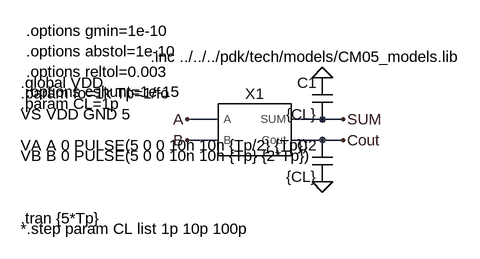
[diagram p0: schematic HA_sim.asc]
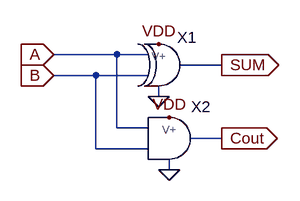
[diagram p1: sub-circuit ha.asc]
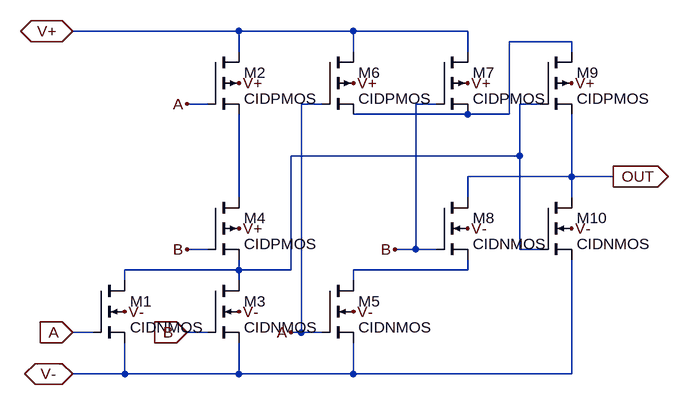
[diagram p2: sub-circuit xor2x1.asc]
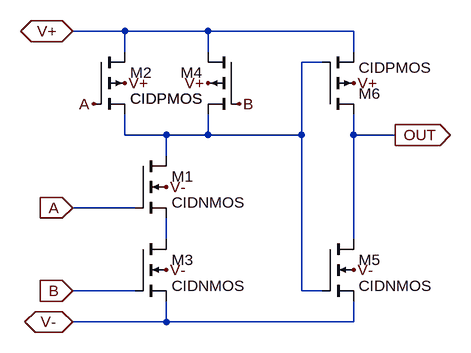
[diagram p3: sub-circuit and2x1.asc]
HA_sim.asc, the LTspice schematic file:
Version 4.1
SHEET 1 880 680
WIRE 48 112 0 112
WIRE 208 112 160 112
WIRE 240 112 208 112
WIRE 48 144 0 144
WIRE 208 144 160 144
WIRE 240 144 208 144
FLAG 0 112 A
FLAG 0 144 B
FLAG 240 112 SUM
FLAG 240 144 Cout
FLAG 208 208 0
FLAG 208 48 0
SYMBOL cap 224 48 M0
SYMATTR InstName C1
SYMATTR Value {CL}
SYMBOL cap 224 144 M0
SYMATTR InstName C2
SYMATTR Value {CL}
SYMBOL HA 96 128 R0
SYMATTR InstName X1
TEXT -56 16 Left 2 !.inc ../../../pdk/tech/models/CM05_models.lib
TEXT -256 152 Left 2 !VA A 0 PULSE(5 0 0 10n 10n {Tp/2} {Tp})
TEXT -256 168 Left 2 !VB B 0 PULSE(5 0 0 10n 10n {Tp} {2*Tp})
TEXT -256 264 Left 2 !.tran {5*Tp}
TEXT -256 56 Left 2 !.global VDD
TEXT -256 88 Left 2 !.param CL=1p
TEXT -256 280 Left 2 !*.step param CL list 1p 10p 100p
TEXT -256 72 Left 2 !.param fo=1k Tp=1/fo
TEXT -248 -24 Left 2 !.options gmin=1e-10\n.options abstol=1e-10\n.options reltol=0.003\n.options cshunt=1e-15
TEXT -256 104 Left 2 !VS VDD GND 5

ha.asc, the sub-circuit schematic file:
Version 4.1
SHEET 1 880 680
WIRE 160 96 64 96
WIRE 208 96 160 96
WIRE 320 112 256 112
WIRE 128 128 64 128
WIRE 208 128 128 128
WIRE 224 160 224 144
WIRE 160 208 160 96
WIRE 208 208 160 208
WIRE 320 224 272 224
WIRE 128 240 128 128
WIRE 208 240 128 240
WIRE 240 272 240 256
FLAG 64 96 A
IOPIN 64 96 In
FLAG 64 128 B
IOPIN 64 128 In
FLAG 320 112 SUM
IOPIN 320 112 Out
FLAG 320 224 Cout
IOPIN 320 224 Out
FLAG 224 80 VDD
FLAG 240 192 VDD
FLAG 224 160 0
FLAG 240 272 0
SYMBOL XOR2X1 224 112 R0
SYMATTR InstName X1
SYMBOL AND2X1 240 224 R0
SYMATTR InstName X2

xor2x1.asc, the sub-circuit schematic file:
Version 4.1
SHEET 1 880 680
WIRE 256 -192 0 -192
WIRE 432 -192 256 -192
WIRE 608 -192 432 -192
WIRE 768 -176 672 -176
WIRE 256 -160 256 -192
WIRE 432 -160 432 -192
WIRE 608 -160 608 -192
WIRE 768 -160 768 -176
WIRE 208 -80 176 -80
WIRE 384 -80 352 -80
WIRE 560 -80 528 -80
WIRE 720 -80 688 -80
WIRE 608 -64 432 -64
WIRE 672 -64 672 -176
WIRE 672 -64 608 -64
WIRE 688 0 688 -80
WIRE 688 0 336 0
WIRE 768 32 768 -64
WIRE 768 32 608 32
WIRE 832 32 768 32
WIRE 256 64 256 -64
WIRE 608 64 608 32
WIRE 768 64 768 32
WIRE 208 144 176 144
WIRE 528 144 528 -80
WIRE 528 144 496 144
WIRE 560 144 528 144
WIRE 688 144 688 0
WIRE 720 144 688 144
WIRE 256 176 256 160
WIRE 256 176 80 176
WIRE 336 176 336 0
WIRE 336 176 256 176
WIRE 608 176 608 160
WIRE 608 176 432 176
WIRE 80 192 80 176
WIRE 256 192 256 176
WIRE 432 192 432 176
WIRE 32 272 0 272
WIRE 208 272 176 272
WIRE 352 272 352 -80
WIRE 352 272 336 272
WIRE 384 272 352 272
WIRE 80 336 80 288
WIRE 80 336 0 336
WIRE 256 336 256 288
WIRE 256 336 80 336
WIRE 432 336 432 288
WIRE 432 336 256 336
WIRE 768 336 768 160
WIRE 768 336 432 336
FLAG 0 272 A
IOPIN 0 272 In
FLAG 176 -80 A
FLAG 0 -192 V+
IOPIN 0 -192 BiDir
FLAG 256 240 V-
FLAG 80 240 V-
FLAG 176 272 B
IOPIN 176 272 In
FLAG 176 144 B
FLAG 256 112 V+
FLAG 256 -112 V+
FLAG 0 336 V-
IOPIN 0 336 BiDir
FLAG 336 272 A
FLAG 432 240 V-
FLAG 608 112 V-
FLAG 432 -112 V+
FLAG 608 -112 V+
FLAG 496 144 B
FLAG 768 -112 V+
FLAG 768 112 V-
FLAG 832 32 OUT
IOPIN 832 32 Out
SYMBOL nmos4 32 192 R0
SYMATTR InstName M1
SYMATTR Value CIDNMOS
SYMATTR Value2 l=5u w=10u
SYMBOL pmos4 208 -160 R0
SYMATTR InstName M2
SYMATTR Value CIDPMOS
SYMATTR Value2 l=5u w=25u
SYMBOL nmos4 208 192 R0
SYMATTR InstName M3
SYMATTR Value CIDNMOS
SYMATTR Value2 l=5u w=10u
SYMBOL pmos4 208 64 R0
SYMATTR InstName M4
SYMATTR Value CIDPMOS
SYMATTR Value2 l=5u w=25u
SYMBOL nmos4 384 192 R0
SYMATTR InstName M5
SYMATTR Value CIDNMOS
SYMATTR Value2 l=5u w=10u
SYMBOL pmos4 384 -160 R0
SYMATTR InstName M6
SYMATTR Value CIDPMOS
SYMATTR Value2 l=5u w=25u
SYMBOL pmos4 560 -160 R0
SYMATTR InstName M7
SYMATTR Value CIDPMOS
SYMATTR Value2 l=5u w=25u
SYMBOL nmos4 560 64 R0
SYMATTR InstName M8
SYMATTR Value CIDNMOS
SYMATTR Value2 l=5u w=10u
SYMBOL pmos4 720 -160 R0
SYMATTR InstName M9
SYMATTR Value CIDPMOS
SYMATTR Value2 l=5u w=25u
SYMBOL nmos4 720 64 R0
SYMATTR InstName M10
SYMATTR Value CIDNMOS
SYMATTR Value2 l=5u w=10u

and2x1.asc, the sub-circuit schematic file:
Version 4.1
SHEET 1 880 680
WIRE 144 -112 64 -112
WIRE 272 -112 144 -112
WIRE 496 -112 272 -112
WIRE 144 -80 144 -112
WIRE 272 -80 272 -112
WIRE 496 -80 496 -112
WIRE 448 -64 416 -64
WIRE 144 48 144 16
WIRE 208 48 144 48
WIRE 272 48 272 16
WIRE 272 48 208 48
WIRE 416 48 416 -64
WIRE 416 48 272 48
WIRE 496 48 496 16
WIRE 560 48 496 48
WIRE 208 80 208 48
WIRE 160 160 64 160
WIRE 208 208 208 176
WIRE 496 208 496 48
WIRE 160 288 64 288
WIRE 416 288 416 48
WIRE 448 288 416 288
WIRE 208 336 208 304
WIRE 208 336 64 336
WIRE 496 336 496 304
WIRE 496 336 208 336
FLAG 64 160 A
IOPIN 64 160 In
FLAG 64 288 B
IOPIN 64 288 In
FLAG 560 48 OUT
IOPIN 560 48 Out
FLAG 96 0 A
FLAG 320 0 B
FLAG 64 336 V-
IOPIN 64 336 BiDir
FLAG 64 -112 V+
IOPIN 64 -112 BiDir
FLAG 208 256 V-
FLAG 208 128 V-
FLAG 144 -32 V+
FLAG 272 -32 V+
FLAG 496 -32 V+
FLAG 496 256 V-
SYMBOL nmos4 160 80 R0
SYMATTR InstName M1
SYMATTR Value CIDNMOS
SYMATTR Value2 l=5u w=10u
SYMBOL pmos4 96 -80 R0
SYMATTR InstName M2
SYMATTR Value CIDPMOS
SYMATTR Value2 l=5u w=25u
SYMBOL nmos4 160 208 R0
SYMATTR InstName M3
SYMATTR Value CIDNMOS
SYMATTR Value2 l=5u w=10u
SYMBOL pmos4 320 -80 M0
SYMATTR InstName M4
SYMATTR Value CIDPMOS
SYMATTR Value2 l=5u w=25u
SYMBOL nmos4 448 208 R0
SYMATTR InstName M5
SYMATTR Value CIDNMOS
SYMATTR Value2 l=5u w=10u
SYMBOL pmos4 448 16 M180
SYMATTR InstName M6
SYMATTR Value CIDPMOS
SYMATTR Value2 l=5u w=25u

The netlist it stands for:
* HA_sim.asc
C1 0 SUM {CL}
C2 Cout 0 {CL}
X§X1 A B Cout SUM ha

* block symbol definitions
.subckt ha A B Cout SUM
X§X1 A B SUM VDD 0 xor2x1
X§X2 A B Cout VDD 0 and2x1
.ends ha

.subckt xor2x1 A B OUT V+ V-
M1 N002 A V- V- CIDNMOS l=5u w=10u
M2 V+ A N003 V+ CIDPMOS l=5u w=25u
M3 N002 B V- V- CIDNMOS l=5u w=10u
M4 N003 B N002 V+ CIDPMOS l=5u w=25u
M5 N004 A V- V- CIDNMOS l=5u w=10u
M6 V+ A N001 V+ CIDPMOS l=5u w=25u
M7 V+ B N001 V+ CIDPMOS l=5u w=25u
M8 OUT B N004 V- CIDNMOS l=5u w=10u
M9 N001 N002 OUT V+ CIDPMOS l=5u w=25u
M10 OUT N002 V- V- CIDNMOS l=5u w=10u
.ends xor2x1

.subckt and2x1 A B OUT V+ V-
M1 N001 A N002 V- CIDNMOS l=5u w=10u
M2 V+ A N001 V+ CIDPMOS l=5u w=25u
M3 N002 B V- V- CIDNMOS l=5u w=10u
M4 V+ B N001 V+ CIDPMOS l=5u w=25u
M5 OUT N001 V- V- CIDNMOS l=5u w=10u
M6 OUT N001 V+ V+ CIDPMOS l=5u w=25u
.ends and2x1

.model NMOS NMOS
.model PMOS PMOS
.lib standard.mos
.inc ../../../pdk/tech/models/CM05_models.lib
VA A 0 PULSE(5 0 0 10n 10n {Tp/2} {Tp})
VB B 0 PULSE(5 0 0 10n 10n {Tp} {2*Tp})
.tran {5*Tp}
.global VDD
.param CL=1p
*.step param CL list 1p 10p 100p
.param fo=1k Tp=1/fo
.options gmin=1e-10
.options abstol=1e-10
.options reltol=0.003
.options cshunt=1e-15
VS VDD GND 5
.backanno
.end